# EAGLE schematic 519_jetson_nano1013 (EAGLE 9.6.0)
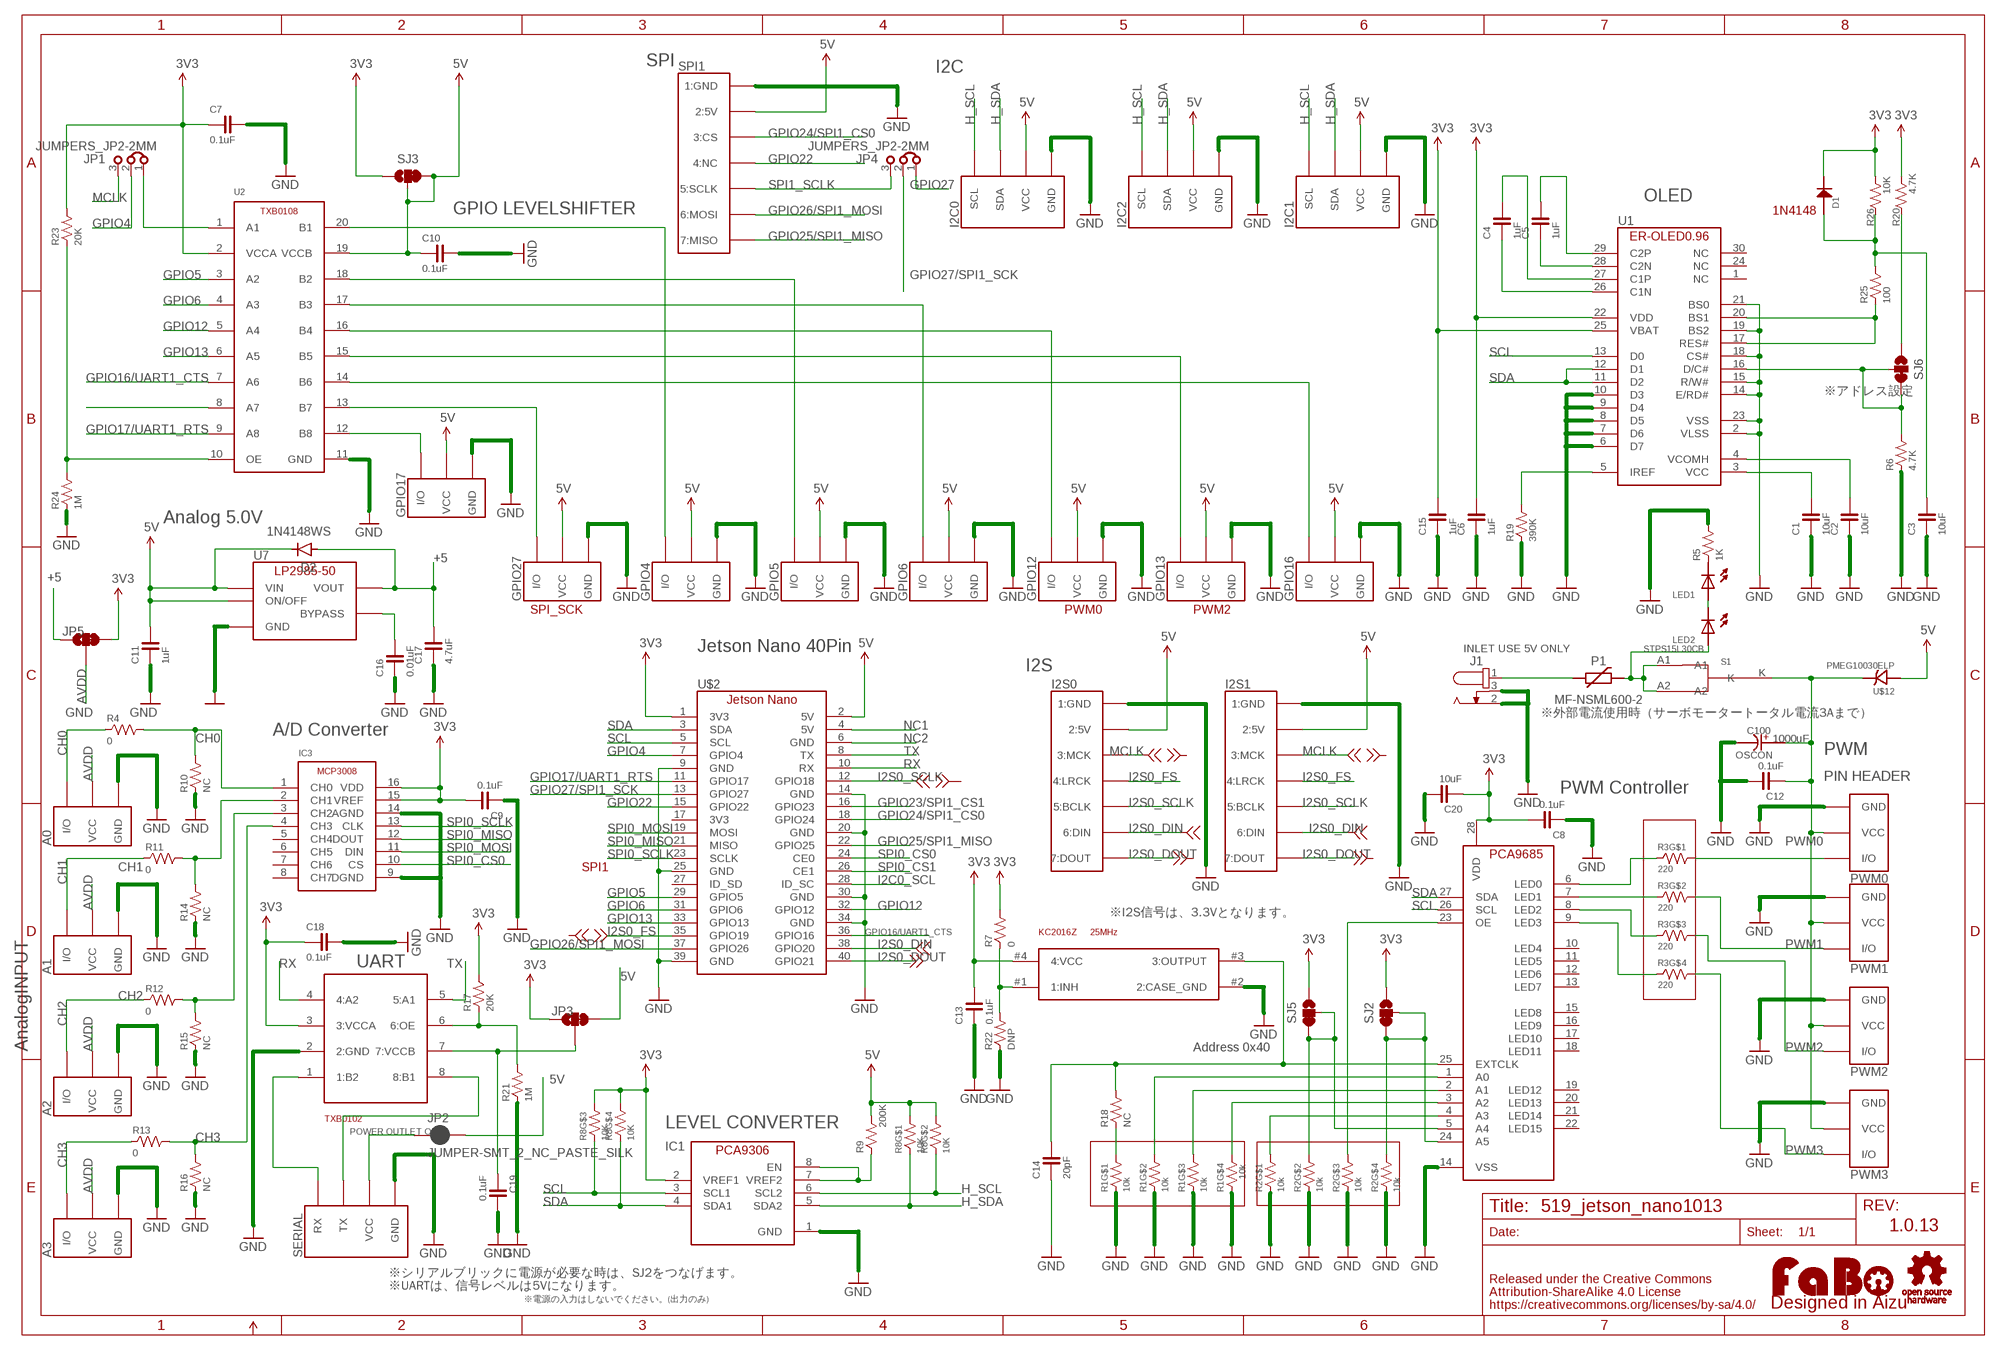
[diagram p0: schematic, sheet 1]

## Parts
A0  FABO_BRICK_3PIN-B03B-PASK-1  [FABO_BRICK_3PIN_B03B-PASK-1]
A1  FABO_BRICK_3PIN-B03B-PASK-1  [FABO_BRICK_3PIN_B03B-PASK-1]
A2  FABO_BRICK_3PIN-B03B-PASK-1  [FABO_BRICK_3PIN_B03B-PASK-1]
A3  FABO_BRICK_3PIN-B03B-PASK-1  [FABO_BRICK_3PIN_B03B-PASK-1]
C1  10uF  CAPACITOR-0603  [0603]
C2  10uF  CAPACITOR-0603  [0603]
C3  10uF  CAPACITOR-0603  [0603]
C4  1uF  CAPACITOR-0603  [0603]
C5  1uF  CAPACITOR-0603  [0603]
C6  1uF  CAPACITOR-0603  [0603]
C7  0.1uF  CAPACITOR-0603  [0603]
C8  0.1uF  CAPACITOR-0603  [0603]
C9  0.1uF  CAPACITOR-0603  [0603]
C10  0.1uF  CAPACITOR-0603  [0603]
C11  1uF  CAPACITOR-0603  [0603]
C12  0.1uF  CAPACITOR-0603  [0603]
C13  0.1uF  CAPACITOR-0402  [0402]
C14  20pF  CAPACITOR-0402  [0402]
C15  1uF  CAPACITOR-0603  [0603]
C16  0.01uF  CAPACITOR-0603  [0603]
C17  4.7uF  CAPACITOR-0603  [0603]
C18  0.1uF  CAPACITOR-0402  [0402]
C19  0.1uF  CAPACITOR-0603  [0603]
C20  10uF  CAPACITOR-0603  [0603]
C100  OSCON  [E7(PANA)]
D1  1N4148  [1N4148W]
D2  1N4148WS  [SOD-323]
GPIO4  FABO_BRICK_3PIN-B03B-PASK-1  [FABO_BRICK_3PIN_B03B-PASK-1]
GPIO5  FABO_BRICK_3PIN-B03B-PASK-1  [FABO_BRICK_3PIN_B03B-PASK-1]
GPIO6  FABO_BRICK_3PIN-B03B-PASK-1  [FABO_BRICK_3PIN_B03B-PASK-1]
GPIO12  FABO_BRICK_3PIN-B03B-PASK-1  [FABO_BRICK_3PIN_B03B-PASK-1]
GPIO13  FABO_BRICK_3PIN-B03B-PASK-1  [FABO_BRICK_3PIN_B03B-PASK-1]
GPIO16  FABO_BRICK_3PIN-B03B-PASK-1  [FABO_BRICK_3PIN_B03B-PASK-1]
GPIO17  FABO_BRICK_3PIN-B03B-PASK-1  [FABO_BRICK_3PIN_B03B-PASK-1]
GPIO27  FABO_BRICK_3PIN-B03B-PASK-1  [FABO_BRICK_3PIN_B03B-PASK-1]
I2C0  FABO_BRICK_I2C-B04B-PASK-1  [FABO_BRICK_I2C_B04B-PASK-1]
I2C1  FABO_BRICK_I2C-B04B-PASK-1  [FABO_BRICK_I2C_B04B-PASK-1]
I2C2  FABO_BRICK_I2C-B04B-PASK-1  [FABO_BRICK_I2C_B04B-PASK-1]
I2S0  FABO-I2S-7PIN  [SPI-B07B-PASK-1]
I2S1  FABO-I2S-7PIN  [SPI-B07B-PASK-1]
IC1  PCA9306_SSOP  [8PIN-SSOP]
IC3  MICROCHIP-MCP3008  [MICROCHIP-MCP3008]
J1  694108301002  [694108301002]
JP1  JUMPERS_JP2-2MM  [JUMPERS_JP2-2MM]
JP2  JUMPER-SMT_2_NC_PASTE_SILK  [SMT-JUMPER_2_NC_PASTE_SILK]
JP3  JUMPER-SMT_3_1-NC_TRACE_SILK  [SMT-JUMPER_3_1-NC_TRACE_SILK]
JP4  JUMPERS_JP2-2MM  [JUMPERS_JP2-2MM]
JP5  JUMPER-SMT_3_1-NC_TRACE_SILK  [SMT-JUMPER_3_1-NC_TRACE_SILK]
LED1  LED-0603  [0603]
LED2  LED-0603  [0603]
LOGO1  LOGO_FABO-M  [LOGO_FABO_M]
P1  MF-NSML600-2  POLYSWITCH1206  [1206]
PWM0  FABO_BRICK_3PIN-HEADER  [FABO_BRICK_3PIN_HEADER]
PWM1  FABO_BRICK_3PIN-HEADER  [FABO_BRICK_3PIN_HEADER]
PWM2  FABO_BRICK_3PIN-HEADER  [FABO_BRICK_3PIN_HEADER]
PWM3  FABO_BRICK_3PIN-HEADER  [FABO_BRICK_3PIN_HEADER]
R1  10k  RESISTOR_ARRAY  [EXBV8V]
R2  10k  RESISTOR_ARRAY  [EXBV8V]
R3  220  RESISTOR_ARRAY  [EXBV8V]
R4  0  RESISTOR-0603  [0603]
R5  1K  RESISTOR-0603  [0603]
R6  4.7K  RESISTOR-0603  [0603]
R7  0  RESISTOR-0402  [0402]
R8  10K  RESISTOR_ARRAY  [EXBV8V]
R9  200K  RESISTOR-0603  [0603]
R10  NC  RESISTOR-0603  [0603]
R11  0  RESISTOR-0603  [0603]
R12  0  RESISTOR-0603  [0603]
R13  0  RESISTOR-0603  [0603]
R14  NC  RESISTOR-0603  [0603]
R15  NC  RESISTOR-0603  [0603]
R16  NC  RESISTOR-0603  [0603]
R17  20K  RESISTOR-0603  [0603]
R18  NC  RESISTOR-0603  [0603]
R19  390K  RESISTOR-0603  [0603]
R20  4.7K  RESISTOR-0603  [0603]
R21  1M  RESISTOR-0603  [0603]
R22  DNP  RESISTOR-0402  [0402]
R23  20K  RESISTOR-0603  [0603]
R24  1M  RESISTOR-0603  [0603]
R25  100  RESISTOR-0603  [0603]
R26  10K  RESISTOR-0603  [0603]
S1  STPS15L30CB  STPS15L30C  [STPS15L30C]
SERIAL  FABO_BRICK_SERIAL-B04B-PASK-1  [FABO_BRICK_SERIAL_B04B-PASK-1]
SJ2  SMD-JUMPER-3-23SHORT  [SMD-JUMPER-3]
SJ3  SMD-JUMPER-3-23SHORT  [SMD-JUMPER-3]
SJ5  SMD-JUMPER-3-23SHORT  [SMD-JUMPER-3]
SJ6  SMD-JUMPER-3-23SHORT  [SMD-JUMPER-3]
SPI1  FABO-SPI-7PIN  [SPI-B07B-PASK-1]
U1  ER-OLED0.96-1ER-CON30HT-1  [ER-CON30HT-1]
U2  TXB0108  [R-PUSON-N20]
U7  LP2985-50  [SOT-23-5]
U$2  JETSON_NANOJETSON_NANO_COMPA  [JETSON_NANO_COMPA]
U$7  TXB0102  [VSSOP8]
U$8  LOGO_OSHW-M_BOTTOM  [LOGO_OSHW_M_BOTTOM]
U$9  PCA9685  [PCA9685]
U$11  KC2016Z  [KC2016Z]
U$12  PMEG10030ELP  [SOD-128]

## Nets
3V3: C6.2 C7.1 C8.2 C9.2 C13.P$2 C15.2 C18.P$1 C20.1 D1.CATHODE IC1.2(VREF1) IC3.15(VREF) IC3.16(VDD) JP3.1 JP5.3 R7.P$2 R8.5 R8.6 R17.2 R20.2 R23.2 R26.2 SJ2.1 SJ3.1 SJ5.1 U1.22(VDD) U1.25(VBAT) U2.2(VCCA) U$2.1(3V3) U$7.3(3:VCCA) U$9.28(VDD) U$11.#4(4:VCC)
5V: C10.1 C11.2 D2.C GPIO4.VCC GPIO5.VCC GPIO6.VCC GPIO12.VCC GPIO13.VCC GPIO16.VCC GPIO17.VCC GPIO27.VCC I2C0.VCC I2C1.VCC I2C2.VCC I2S0.2(2:5V) I2S1.2(2:5V) JP2.2 JP3.3 R8.7 R8.8 R9.2 SJ3.2 SJ3.3 SPI1.2(2:5V) U2.19(VCCB) U7.1(VIN) U7.3(ON/OFF) U$2.2(5V) U$12.A(ANODE)
+5: C17.2 D2.A JP5.1 U7.5(VOUT)
AVDD: A0.VCC A1.VCC A2.VCC A3.VCC JP5.2
CH0: A0.I/O R4.1
CH1: A1.I/O R11.1
CH2: A2.I/O R12.1
CH3: A3.I/O R13.1
GND: A0.GND A1.GND A2.GND A3.GND C1.1 C2.1 C3.1 C6.1 C7.2 C8.1 C9.1 C10.2 C11.1 C12.2 C13.P$1 C14.P$1 C15.1 C16.1 C17.1 C18.P$2 C19.2 C20.2 C100.MINUS(-) GPIO4.GND GPIO5.GND GPIO6.GND GPIO12.GND GPIO13.GND GPIO16.GND GPIO17.GND GPIO27.GND I2C0.GND I2C1.GND I2C2.GND I2S0.1(1:GND) I2S1.1(1:GND) IC1.1(GND) IC3.9(DGND) IC3.14(AGND) J1.2 J1.3 PWM0.GND PWM1.GND PWM2.GND PWM3.GND R1.1 R1.2 R1.3 R1.4 R2.1 R2.2 R2.3 R2.4 R5.2 R6.1 R10.1 R14.1 R15.1 R16.1 R19.1 R21.1 R22.P$1 R24.1 SERIAL.GND SPI1.1(1:GND) U1.2(VLSS) U1.6(D7) U1.7(D6) U1.8(D5) U1.9(D4) U1.10(D3) U1.14(E/RD#) U1.15(R/W#) U1.18(CS#) U1.19(BS2) U1.21(BS0) U1.23(VSS) U2.11(GND) U7.2(GND) U$2.9(GND) U$2.14(GND) U$2.20(GND) U$2.25(GND) U$2.30(GND) U$2.34(GND) U$2.39(GND) U$7.2(2:GND) U$9.14(VSS) U$11.#2(2:CASE_GND)
GPIO4: JP1.2 U$2.7(GPIO4)
GPIO5: U2.3(A2) U$2.29(GPIO5)
GPIO6: U2.4(A3) U$2.31(GPIO6)
GPIO12: U2.5(A4) U$2.32(GPIO12)
GPIO13: U2.6(A5) U$2.33(GPIO13)
GPIO16/UART1_CTS: U2.7(A6) U$2.36(GPIO16)
GPIO17/UART1_RTS: U2.9(A8) U$2.11(GPIO17)
GPIO22: SPI1.4(4:NC) U$2.15(GPIO22)
GPIO23/SPI1_CS1: U$2.16(GPIO23)
GPIO24/SPI1_CS0: SPI1.3(3:CS) U$2.18(GPIO24)
GPIO25/SPI1_MISO: SPI1.7(7:MISO) U$2.22(GPIO25)
GPIO26/SPI1_MOSI: SPI1.6(6:MOSI) U$2.37(GPIO26)
GPIO27: JP4.1 U2.8(A7)
GPIO27/SPI1_SCK: JP4.2 U$2.13(GPIO27)
H_SCL: I2C0.SCL I2C1.SCL I2C2.SCL IC1.6(SCL2) R8.2
H_SDA: I2C0.SDA I2C1.SDA I2C2.SDA IC1.5(SDA2) R8.1
I2C0_SCL: U$2.28(ID_SC)
I2S0_DIN: I2S0.6(6:DIN) I2S1.6(6:DIN) U$2.38(GPIO20)
I2S0_DOUT: I2S0.7(7:DOUT) I2S1.7(7:DOUT) U$2.40(GPIO21)
I2S0_FS: I2S0.4(4:LRCK) I2S1.4(4:LRCK) U$2.35(GPIO19)
I2S0_SCLK: I2S0.5(5:BCLK) I2S1.5(5:BCLK) U$2.12(GPIO18)
MCLK: I2S0.3(3:MCK) I2S1.3(3:MCK) JP1.3
N$2: R3.1 U$9.6(LED0)
N$3: R3.2 U$9.7(LED1)
N$4: R1.7 U$9.1(A0)
N$5: R3.3 U$9.8(LED2)
N$6: R3.4 U$9.9(LED3)
N$7: R2.6 U$9.23(OE)
N$8: C14.P$2 R18.2 U$9.25(EXTCLK) U$11.#3(3:OUTPUT)
N$9: GPIO4.I/O U2.20(B1)
N$10: R1.6 U$9.2(A1)
N$11: R1.5 U$9.3(A2)
N$12: R2.8 U$9.4(A3)
N$13: SERIAL.RX U$7.1(1:B2)
N$14: C4.2 U1.27(C1P)
N$15: GPIO5.I/O U2.18(B2)
N$16: C4.1 U1.26(C1N)
N$17: GPIO6.I/O U2.17(B3)
N$18: GPIO12.I/O U2.16(B4)
N$19: C5.1 U1.28(C2N)
N$20: GPIO13.I/O U2.15(B5)
N$21: C5.2 U1.29(C2P)
N$22: GPIO16.I/O U2.14(B6)
N$23: R19.2 U1.5(IREF)
N$24: C2.2 U1.4(VCOMH)
N$25: C1.2 U1.3(VCC)
N$26: R25.1 U1.17(RES#) U1.20(BS1)
N$27: C3.2 D1.ANODE R25.2 R26.1
N$28: R23.1 R24.2 U2.10(OE)
N$29: GPIO27.I/O U2.13(B7)
N$30: SERIAL.TX U$7.8(8:B1)
N$31: IC3.3(CH2) R12.2 R15.2
N$32: JP1.1 U2.1(A1)
N$33: IC1.7(VREF2) IC1.8(EN) R9.1
N$34: IC3.1(CH0) R4.2 R10.2
N$35: JP2.1 SERIAL.VCC
N$36: IC3.2(CH1) R11.2 R14.2
N$37: LED1.ANODE LED2.CATHODE
N$38: IC3.4(CH3) R13.2 R16.2
N$39: LED2.ANODE P1.P$2 S1.A1 S1.A2
N$40: C16.2 U7.4(BYPASS)
N$41: C12.1 C100.PLUS(+) PWM0.VCC PWM1.VCC PWM2.VCC PWM3.VCC S1.K U$12.K(CATHODE)
N$42: J1.1 P1.P$1
N$43: R2.7 SJ5.2 SJ5.3 U$9.5(A4)
N$44: R2.5 SJ2.2 SJ2.3 U$9.24(A5)
N$45: R17.1 R21.2 U$7.6(6:OE)
N$46: R6.2 SJ6.2 SJ6.3 U1.16(D/C#)
N$47: R20.1 SJ6.1
N$48: GPIO17.I/O U2.12(B8)
N$50: R7.P$1 R22.P$2 U$11.#1(1:INH)
N$51: LED1.CATHODE R5.1
N$52: R1.8 R18.1
N$53: C19.1 JP3.2 U$7.7(7:VCCB)
NC1: U$2.4(5V)
NC2: U$2.6(GND)
PWM0: PWM0.I/O R3.8
PWM1: PWM1.I/O R3.7
PWM2: PWM2.I/O R3.6
PWM3: PWM3.I/O R3.5
RX: U$2.10(RX) U$7.4(4:A2)
SCL: IC1.3(SCL1) R8.3 U1.13(D0) U$2.5(SCL) U$9.26(SCL)
SDA: IC1.4(SDA1) R8.4 U1.11(D2) U1.12(D1) U$2.3(SDA) U$9.27(SDA)
SPI0_CS0: IC3.10(CS) U$2.24(CE0)
SPI0_CS1: U$2.26(CE1)
SPI0_MISO: IC3.12(DOUT) U$2.21(MISO)
SPI0_MOSI: IC3.11(DIN) U$2.19(MOSI)
SPI0_SCLK: IC3.13(CLK) U$2.23(SCLK)
SPI1_SCLK: JP4.3 SPI1.5(5:SCLK)
TX: U$2.8(TX) U$7.5(5:A1)
Unconnected: IC3.5(CH4) IC3.6(CH5) IC3.7(CH6) IC3.8(CH7) U1.1(NC) U1.24(NC) U1.30(NC) U$2.17(3V3) U$2.27(ID_SD) U$9.10(LED4) U$9.11(LED5) U$9.12(LED6) U$9.13(LED7) U$9.15(LED8) U$9.16(LED9) U$9.17(LED10) U$9.18(LED11) U$9.19(LED12) U$9.20(LED13) U$9.21(LED14) U$9.22(LED15)

## Notes on the sheet
- SPI
- I2C
- OLED
- GPIO LEVELSHIFTER | 1N4148
- ※アドレス設定
- Analog 5.0V
- SPI_SCK | PWM0 | PWM2
- Jetson Nano 40Pin | INLET USE 5V ONLY
- I2S
- ※外部電流使用時（サーボモータートータル電流3Aまで）
- A/D Converter
- 1000uF
- PWM
- PIN HEADER
- PWM Controller
- SPI1
- ※I2S信号は、3.3Vとなります。
- UART
- AnalogINPUT | Address 0x40
- LEVEL CONVERTER
- POWER OUTLET ONLY
- 1.0.13
- ※シリアルブリックに電源が必要な時は、SJ2をつなげます。
- ※UARTは、信号レベルは5Vになります。
- ※電源の入力はしないでください。(出力のみ)

## Library data of the parts
A0 A1-A3 GPIO4-GPIO6 GPIO12 GPIO13 GPIO16 GPIO17 GPIO27 PWM0 PWM1-PWM3 = FaBo-Template:FABO_BRICK_3PIN: FaBo Brick 3pin
C1-C20 = FaBo-Capacitor:CAPACITOR: CAPACITOR
C100 = FaBo-Capacitor:OSCON
D1 = FaBo-Diode:1N4148
D2 = Diodes:1N4148WS: DIODE GEN PURP 75V 150MA SOD323F Manufacturer's datasheet <https://www.onsemi.com/pub/Collateral/1N914BWS-D.pdf>; CREATED_BY: PCBLayout.com; DIGIKEY_PART_NUMBER: 1N4148WSFSTR-ND; MANUFACTURER: Diodes Incorporated; MPN: 1N4148WS; PACKAGE: SOD-323
I2C0 I2C1 I2C2 = FaBo-Template:FABO_BRICK_I2C: FaBo Brick I2C
I2S0 I2S1 = FaBo-Connetor:FABO-I2S-7PIN
IC1 = FaBo-LevelTranslator:PCA9306
IC3 = FaBo-ADC:MICROCHIP-MCP3008
J1 = Wurth_Connectors_WR-DC:694108301002: WR-DC DC Power Jack Right Angled (6.4) KIND PROPERTIES Quality Class 5 000 Mating cycles Type Right Angled MATERIAL PROPERTIES Insulator Material PA66 Insulator Flammability Rating UL94 V-0 Color Black Contact Material Copper Alloy Contact Type Stamped Center Pin Plating Gold Center Pin Terminal Plating Tin Tip Spring Material Tin Shunt Terminal Plating Tin GENERAL INFORMATION Operating Temperature -40 up to +85 °C Compliance RoHS ELECTRICAL PROPERTIES IR 1 5 A Working Voltage 30 V (AC) Withstanding Voltage 500 V (AC) Contact Resistance 50 mΩ RISO 100 MΩ PACKAGING PROPERTIES Packaging Bag <https://katalog.we-online.com/media/images/v2/o59009v209%20Family_WR-DC_DC_Power_Jack_Right_Angled_THT_69410x301002.jpg> Details see: https://katalog.we-online.com/en/em/DC_RIGHT_ANGLED_6_4_69410X301002 Updated by Ella Wu 2019-11-01 2019(C) Wurth Elektronik; DATASHEET-URL: https://katalog.we-online.com/em/datasheet/694108301002.pdf; IR: 5A; MOUNT: THT; PART-NUMBER: 694108301002; TYPE: Right Angled; WORKING-VOLTAGE: 30V(AC)
JP1 JP4 = 52101-101-REV-A_v16:JUMPERS_JP2-: Jumper/Bridge
JP2 = SparkFun-Jumpers:JUMPER-SMT_2_NC_PASTE: Normally closed solder jumper This jumper has an aperture in the stencil to allow solder paste to bridge the split in the wire so it's normally closed (NC). Wick off the solder to open the connection. Reapply solder to reclose the connection.
JP3 JP5 = SparkFun-Jumpers:JUMPER-SMT_3_1-NC_TRACE: Normally closed trace jumper (1 of 2 connections) This jumper has a trace between two pads so it's normally closed (NC). The other connection is normally open (NO). Use a razor knife to open the connection. For best results follow the IPC guidelines for cutting traces: Cutout at least 0.063 mm (0.005 in). Remove all loose material to clean up the cut area. Seal the cut with an approved epoxy. Reapply solder to reclose the connection, or to close the NO connection.
LED1 LED2 = FaBo-LED:LED
LOGO1 = component:LOGO_FABO
P1 = FaBo-Supply:POLYSWITCH
R1-R3 R8 = component:RESISTOR_ARRAY
R4-R7 R9-R26 = FaBo-Resistors:RESISTOR: RESISTOR
S1 = FaBo-Supply:STPS15L30C
SERIAL = FaBo-Template:FABO_BRICK_SERIAL: FaBo Brick Serial
SJ2 SJ3 SJ5 SJ6 = FaBo-etc:SMD-JUMPER-3-23SHORT
SPI1 = FaBo-Connetor:FABO-SPI-7PIN
U1 = FaBo-Display:ER-OLED0.96-1
U2 = FaBo-LevelTranslator:TXB0108
U7 = FaBo-Supply:LP2985-50
U$2 = FaBo-Boards:JETSON_NANO
U$7 = FaBo-LevelTranslator:TXB0102
U$8 = component:LOGO_OSHW
U$9 = FaBo-Motor:PCA9685
U$11 = FaBo-Crystal:KC2016Z
U$12 = FaBo-Diode:PMEG10030ELP